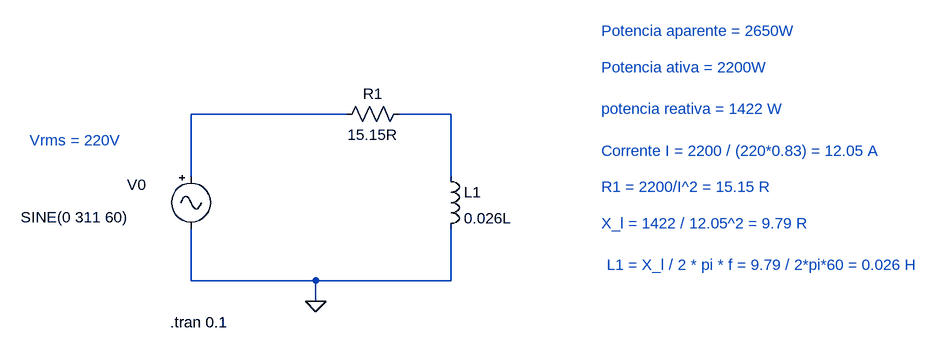
[diagram p0: schematic Circuito_sem_capacitor.asc]
Circuito_sem_capacitor.asc, the LTspice schematic file:
Version 4
SHEET 1 1548 680
WIRE 240 64 0 64
WIRE 400 64 320 64
WIRE 0 160 0 64
WIRE 400 160 400 64
WIRE 0 320 0 240
WIRE 192 320 0 320
WIRE 400 320 400 240
WIRE 400 320 192 320
WIRE 192 352 192 320
FLAG 192 352 0
SYMBOL Misc\\signal 0 144 R0
WINDOW 123 0 0 Left 0
WINDOW 39 -262 113 Left 2
WINDOW 0 -98 29 Left 2
WINDOW 3 -262 79 Left 2
SYMATTR InstName V0
SYMATTR Value SINE(0 311 60)
SYMBOL res 336 48 R90
WINDOW 0 0 56 VBottom 2
WINDOW 3 32 56 VTop 2
SYMATTR InstName R1
SYMATTR Value 15.15R
SYMBOL ind 384 144 R0
SYMATTR InstName L1
SYMATTR Value 0.026L
TEXT -32 384 Left 2 !.tran 0.1
TEXT -248 104 Left 2 ;Vrms = 220V
TEXT 632 -64 Left 2 ;Potencia aparente = 2650W
TEXT 632 -8 Left 2 ;Potencia ativa = 2200W
TEXT 632 56 Left 2 ;potencia reativa = 1422 W
TEXT 632 120 Left 2 ;Corrente I = 2200 / (220*0.83) = 12.05 A
TEXT 632 176 Left 2 ;R1 = 2200/I^2 = 15.15 R
TEXT 632 232 Left 2 ;X_l = 1422 / 12.05^2 = 9.79 R
TEXT 640 296 Left 2 ;L1 = X_l / 2 * pi * f = 9.79 / 2*pi*60 = 0.026 H

The netlist it stands for:
* Circuito_sem_capacitor.asc
V0 N001 0 SINE(0 311 60)
R1 N002 N001 15.15R
L1 N002 0 0.026L
.tran 0.1
* Vrms = 220V
* Potencia aparente = 2650W
* Potencia ativa = 2200W
* potencia reativa = 1422 W
* Corrente I = 2200 / (220*0.83) = 12.05 A
* R1 = 2200/I^2 = 15.15 R
* X_l = 1422 / 12.05^2 = 9.79 R
* L1 = X_l / 2 * pi * f = 9.79 / 2*pi*60 = 0.026 H
.backanno
.end